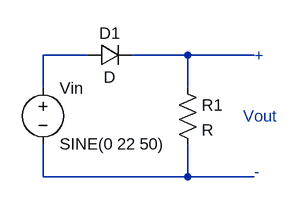
[diagram p0: schematic HalfWaveCircuit.asc]
HalfWaveCircuit.asc, the LTspice schematic file:
Version 4
SHEET 1 880 680
WIRE 368 224 304 224
WIRE 512 224 432 224
WIRE 608 224 512 224
WIRE 304 272 304 224
WIRE 512 272 512 224
WIRE 304 400 304 352
WIRE 512 400 512 352
WIRE 512 400 304 400
WIRE 608 400 512 400
SYMBOL diode 368 240 R270
WINDOW 0 32 32 VTop 2
WINDOW 3 0 32 VBottom 2
SYMATTR InstName D1
SYMBOL res 496 256 R0
SYMATTR InstName R1
SYMBOL voltage 304 256 R0
SYMATTR InstName Vin
SYMATTR Value SINE(0 22 50)
TEXT 592 312 Left 2 ;Vout
TEXT 608 224 Left 2 ;+
TEXT 608 392 Left 2 ;-

The netlist it stands for:
* HalfWaveCircuit.asc
D1 N001 N002 D
R1 N002 N003 R
Vin N001 N003 SINE(0 22 50)
.model D D
.lib standard.dio
* Vout
* +
* -
.backanno
.end